# EAGLE design pid interface w term (EAGLE 7.3.0)
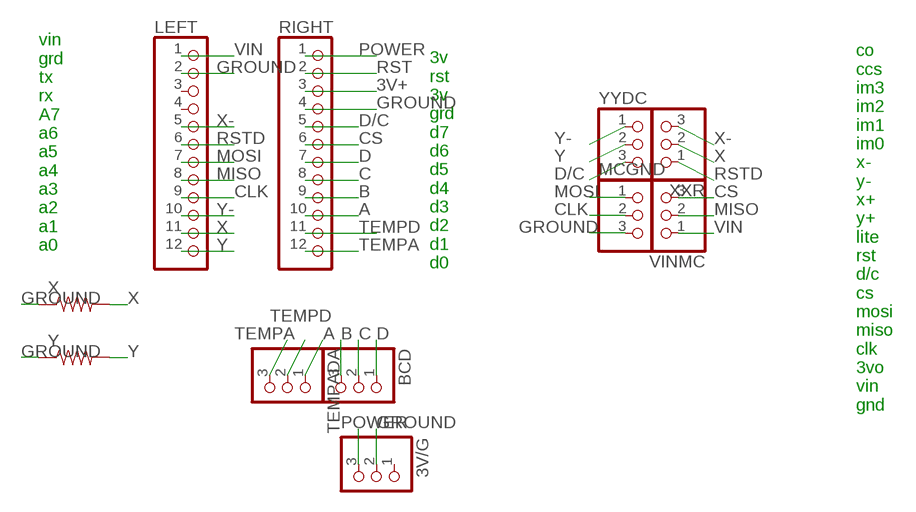
[diagram p0: schematic, sheet 1]

## Parts
3V/G  PINHD-1X3CB  [1X03-CLEANBIG]
BCD  PINHD-1X3CB  [1X03-CLEANBIG]
LEFT  PINHD-1X12-CB  [1X12-CB]
MCGND  PINHD-1X3CB  [1X03-CLEANBIG]
RIGHT  PINHD-1X12-CB  [1X12-CB]
TEMPADA  PINHD-1X3CB  [1X03-CLEANBIG]
VINMC  PINHD-1X3CB  [1X03-CLEANBIG]
X  10KOHM-1/6W-5%(PTH)KIT  [AXIAL-0.3-KIT]
XXR  PINHD-1X3CB  [1X03-CLEANBIG]
Y  10KOHM-1/6W-5%(PTH)KIT  [AXIAL-0.3-KIT]
YYDC  PINHD-1X3CB  [1X03-CLEANBIG]

## Nets
3V+: RIGHT.3
A: RIGHT.10 TEMPADA.1
B: BCD.3 RIGHT.9
C: BCD.2 RIGHT.8
CLK: LEFT.9 MCGND.2
CS: RIGHT.6 VINMC.3
D: BCD.1 RIGHT.7
D/C: RIGHT.5 YYDC.3
GROUND: 3V/G.2 LEFT.2 MCGND.3 RIGHT.4 X.P$1 Y.P$1
MISO: LEFT.8 VINMC.2
MOSI: LEFT.7 MCGND.1
POWER: 3V/G.3 RIGHT.1
RST: RIGHT.2
RSTD: LEFT.6 XXR.1
TEMPA: RIGHT.12 TEMPADA.3
TEMPD: RIGHT.11 TEMPADA.2
VIN: LEFT.1 VINMC.1
X: LEFT.11 X.P$2 XXR.2
X-: LEFT.5 XXR.3
Y: LEFT.12 Y.P$2 YYDC.2
Y-: LEFT.10 YYDC.1
Unconnected: 3V/G.1 LEFT.3 LEFT.4

## Notes on the sheet
- vin
  grd
  tx
  rx
  A7
  a6
  a5
  a4
  a3
  a2
  a1
  a0
- 3v
  rst
  3v
  grd
  d7
  d6
  d5
  d4
  d3
  d2
  d1
  d0
- co
  ccs
  im3
  im2
  im1
  im0
  x-
  y-
  x+
  y+
  lite
  rst
  d/c
  cs
  mosi
  miso
  clk
  3vo
  vin
  gnd

## Library data of the parts
3V/G BCD MCGND TEMPADA VINMC XXR YYDC = adafruit:PINHD-1X3: PIN HEADER
LEFT RIGHT = adafruit:PINHD-1X12: PIN HEADER
X Y = SparkFun-Resistors:10KOHM-1/6W-5%(PTH): RES-08375; PROD_ID: RES-08375

## Board
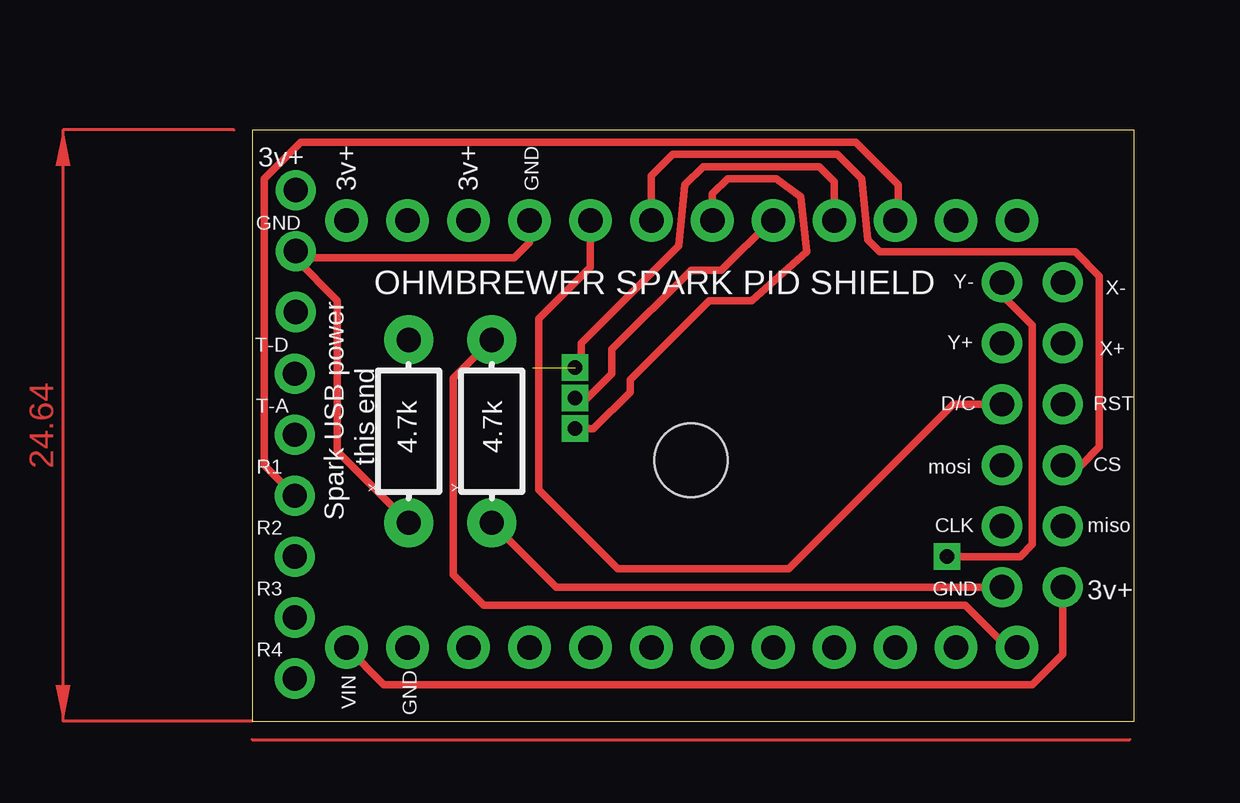
[diagram p1: board, top side]
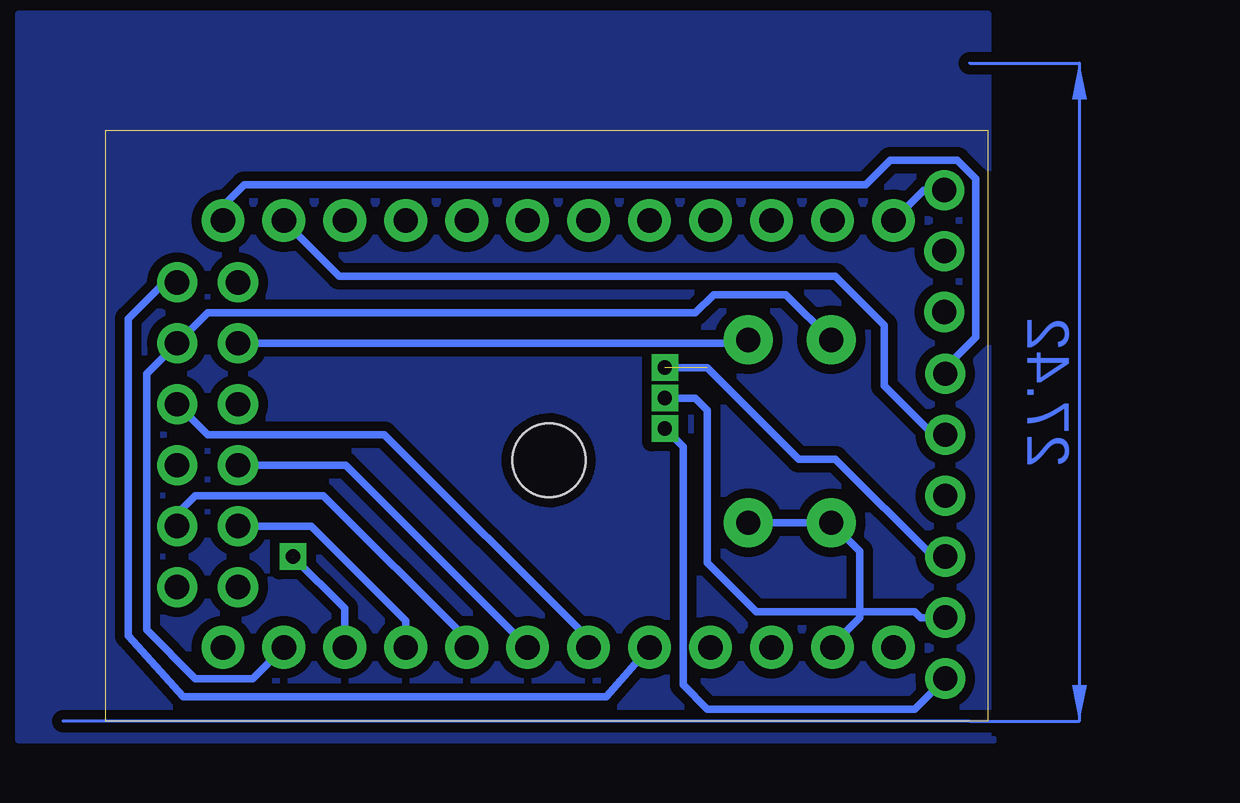
[diagram p2: board, bottom side, seen from below]

Size 36.75 x 24.63 mm. Coordinates in mm from the lower left corner, seen from the top.
Outline: 0,0 36.75,0 36.75,24.63 0,24.63 0,0
Copper layers (1*16): Top 0.035mm / dielectric 1.5mm / Bottom 0.035mm
Design rules "Othermill-DRC-1-64": minimum track width 8mil, minimum drill 0.8mm, track to track 0.39878125mm, track to pad 0.39878125mm, pad to pad 0.39878125mm, via to via 0.39878125mm, smd to smd 0mil, copper to edge 0mil, drill to drill 1mil, minimum pad ring 10mil, minimum via ring 10mil, stop-mask expansion 1mil, vias tented up to drill 30mil, thermal gap 10mil

### Footprints (pad centres in the part's own frame; a part is rotated, then mirrored left to right if it is on the bottom)
1X03-CLEANBIG = drill 1.016 pad 1.676: 1 -2.54,0; 2 0,0; 3 2.54,0
1X12-CB = drill 1.016 pad 1.778: 1 -13.97,0; 2 -11.43,0; 3 -8.89,0; 4 -6.35,0; 5 -3.81,0; 6 -1.27,0; 7 1.27,0; 8 3.81,0; 9 6.35,0; 10 8.89,0; 11 11.43,0; 12 13.97,0
STAND-OFF-TIGHT = hole 3.048: 0,0
AXIAL-0.3-KIT = drill 1.016 pad 2.032: P$1 -3.81,0; P$2 3.81,0

### Placement (x,y rotation side)
3V/G  1.82,19.59 90 top
BCD  1.78,4.32 90 top
LEFT  17.91,3.08 0 top
MCGND  31.24,8.13 270 top
RIGHT  17.91,20.86 0 top
TEMPADA  1.78,11.94 90 top
U$1  [STAND-OFF-TIGHT]  18.3,10.87 0 top
VINMC  33.78,8.13 90 top
X  6.53,12.08 90 top
XXR  33.78,15.75 90 top
Y  9.99,12.08 90 top
YYDC  31.24,15.75 270 top

### Tracks (layer width: path | path; a pad name or v marks a point on that pad's centre or on a via)
A
  Top 0.305: TEMPADA.1 0.51,10.67 0.51,22.61 2.03,24.13 25.15,24.13 26.92,22.35 26.92,20.99 RIGHT.10
B  (3 unrouted)
  Top 0.305: RIGHT.9 24.26,22.48 23.62,23.11 18.8,23.11 18.03,22.35 17.78,19.81 13.72,15.75 13.72,14.99 13.46,14.73
  Bottom 0.305: BCD.3 2.29,6.86 6.35,10.92 7.87,10.92 11.68,14.73 13.46,14.73
C  (via drill 0.6)
  Top 0.305: RIGHT.8 21.62,20.86 19.56,18.8 18.29,18.8 14.99,15.49 14.99,14.48 13.97,13.46 v13.46,13.46
  Bottom 0.305: BCD.2 2.79,4.32 3.05,4.57 9.65,4.57 11.68,6.6 11.68,12.95 12.19,13.46 v13.46,13.46
CLK
  Bottom 0.305: LEFT.9 24.26,4.19 28.19,8.13 MCGND.2
CS
  Top 0.305: VINMC.3 34.54,10.67 35.31,11.43 35.31,18.54 34.29,19.56 26.16,19.56 25.65,20.07 25.4,22.61 24.38,23.62 17.53,23.62 16.64,22.73 RIGHT.6
D  (via drill 0.6)
  Top 0.305: RIGHT.7 19.18,21.97 19.81,22.61 21.84,22.61 22.86,21.84 23.11,19.56 20.83,17.53 19.05,17.53 15.75,14.22 15.75,13.72 14.22,12.19 v13.46,12.19
  Bottom 0.305: BCD.1 3.05,0.51 11.68,0.51 12.7,1.52 12.7,11.43 v13.46,12.19
D/C
  Top 0.305: RIGHT.5 14.1,18.92 11.94,16.76 11.94,9.65 15.24,6.35 22.35,6.35 29.21,13.21 YYDC.3
GROUND
  Top 0.305: MCGND.3 12.67,5.59 Y.P$1 | RIGHT.4 11.56,19.94 10.92,19.3 2.1,19.3 3V/G.2 1.82,19.26 3.56,17.53 3.56,11.24 X.P$1
  Bottom 0.305: Y.P$1 X.P$1 5.33,7.08 5.33,4.32 6.35,3.3 6.35,3.21 LEFT.2
MISO
  Bottom 0.305: LEFT.8 21.72,3.43 27.69,9.4 33.02,9.4 33.53,8.89 33.53,8.38 VINMC.2
MOSI
  Bottom 0.305: MCGND.1 26.76,10.67 LEFT.7
N$1
  pour Bottom: 0,29.46 40.39,29.46 40.39,-0.76 -0.25,-0.76 0,-0.76
N$2  (via drill 0.6)
  other vias: 28.96,6.86
N$3  (via drill 0.6)
  other vias: 13.46,14.73
POWER
  Bottom 0.305: 3V/G.3 2.67,22.13 RIGHT.1
RSTD
  Bottom 0.305: LEFT.6 16.64,3.43 25.15,11.94 32.51,11.94 XXR.1
TEMPA
  Bottom 0.305: TEMPADA.3 1.78,14.73 0.51,16 0.51,22.61 1.27,23.37 4.06,23.37 5.08,22.35 30.99,22.35 31.75,21.59 31.75,20.99 RIGHT.12
TEMPD
  Bottom 0.305: TEMPADA.2 2.29,11.94 4.32,13.97 4.32,16.51 6.35,18.54 27.02,18.54 RIGHT.11
VIN
  Top 0.305: VINMC.1 33.78,2.79 32.51,1.52 5.49,1.52 LEFT.1
X
  Bottom 0.305: X.P$2 8.41,17.78 11.43,17.78 12.19,17.02 32.51,17.02 XXR.2 35.05,14.48 35.05,3.81 33.02,1.78 30.64,1.78 LEFT.11
X-
  Bottom 0.305: XXR.3 34.29,18.29 35.81,16.76 35.81,3.56 33.53,1.02 15.91,1.02 LEFT.5
Y
  Top 0.305: LEFT.12 31.46,3.08 29.72,4.83 9.65,4.83 8.38,6.1 8.38,14.29 Y.P$2
  Bottom 0.305: YYDC.2 10.13,15.75 Y.P$2
Y-  (1 unrouted)
  Top 0.305: YYDC.1 31.24,17.78 32.51,16.51 32.51,7.37 32,6.86 28.96,6.86 28.83,6.73
  Bottom 0.305: LEFT.10 26.8,4.7 28.96,6.86
(copper drawn outside any net)
  shapes: Bottom area x4, Top area x2

### Text on the board
tSilk: 3v+ | 3v+ | 3v+ | GND | GND | OHMBREWER SPARK PID SHIELD | Y- | X- | T-D | Y+ | X+ | T-A | D/C | RST | R1 | this end | 4.7k | 4.7k | mosi | CS | R2 | Spark USB power | CLK | miso | R3 | GND | 3v+ | R4 | VIN | GND